# EasyEDA schematic SCH_Line_follower_tutorial_2023-11-12.json
TITLE: Sheet_Line_Follower; REV: 1.0; Date: 2023-10-26; Sheet: 1/1; Drawn By: DevelTeam; Company: DevelTeam
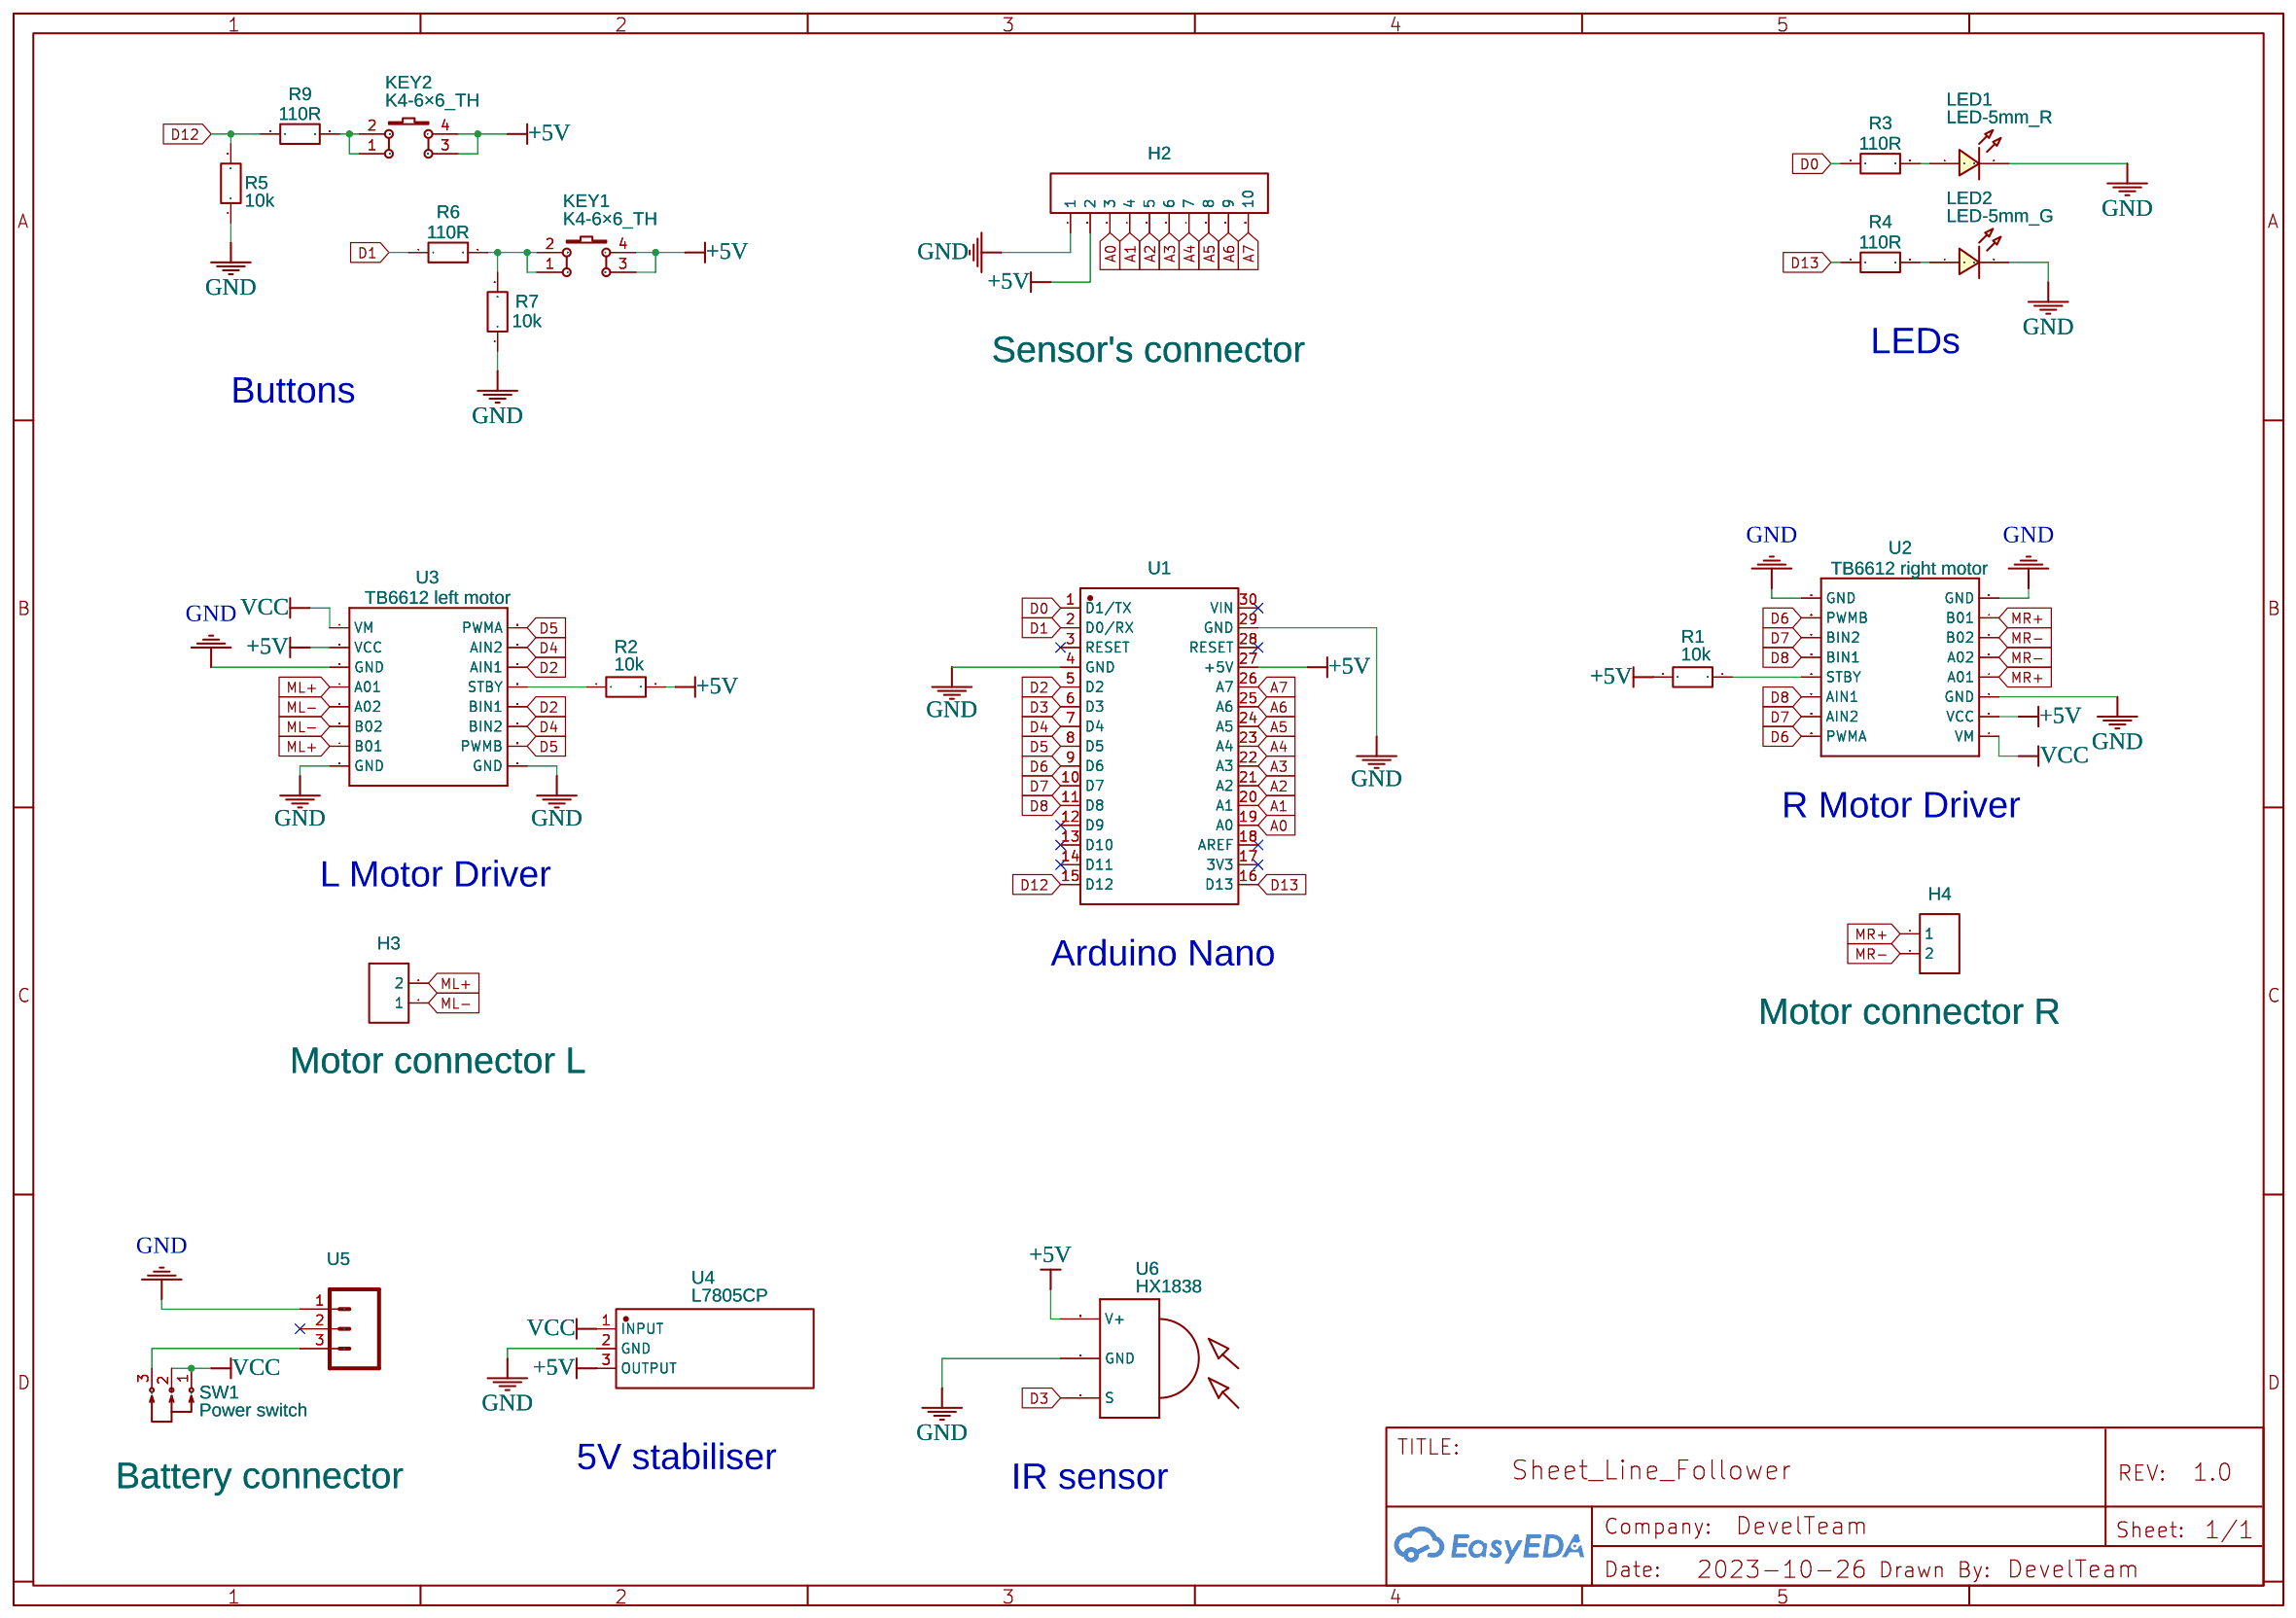
[diagram p0: schematic sheet]

## Parts
H2  Sensor's connector  [HDR-F-2.54_1X10]
H3  Motor connector L  [HDR-F-2.54_1X2]
H4  Motor connector R  [HDR-F-2.54_1X2]
KEY1  K4-6×6_TH  [KEY-TH_4P-L6.0-W6.0-P4.50-LS6.5]
KEY2  K4-6×6_TH  [KEY-TH_4P-L6.0-W6.0-P4.50-LS6.5]
LED1  LED-5mm_R  [LED-TH_BD5.0_RED]
LED2  LED-5mm_G  [LED-TH_BD5.0_GREEN]
R1  10k  [R_AXIAL-0.4]
R2  10k  [R_AXIAL-0.4]
R3  110R  [R_AXIAL-0.4]
R4  110R  [R_AXIAL-0.4]
R5  10k  [R_AXIAL-0.4]
R6  110R  [R_AXIAL-0.4]
R7  10k  [R_AXIAL-0.4]
R9  110R  [R_AXIAL-0.4]
SW1  Power switch  [SW-TH_SHOU-HAN_SS12D10G4]
U1  ARDUINO_NANO  [COMM-TH_ARDUINO_NANO]
U2  TB6612 right motor  [DUAL TB6612FNG]
U3  TB6612 left motor  [DUAL TB6612FNG]
U4  L7805CP  [TO-220FPAB-3_L10.4-W4.6-P2.54-T]
U5  Battery connector  [W-03 2.54]
U6  HX1838  [HX1838 STAND ALONE]

## Library data of the parts
H2 = HDR-F-2.54_1x10: Supplier Part: C35445; Supplier: LCSC; Contributor: LCEDA_Lib
H3 H4 = HDR-F-2.54_1x2: Supplier Part: C49661; Supplier: LCSC; Contributor: LCEDA_Lib
KEY1 KEY2 = K4-6×6_TH: Supplier: LCSC; Supplier Part: C136684; Manufacturer: 韩国韩荣; Manufacturer Part: K2-1102DP-E4SW-04; Contributor: LCEDA_Lib
LED1 = LED-TH-5mm_R: Manufacturer: EVERLIGHT(台湾亿光); Manufacturer Part: 333-2SURD/S530-A3; Supplier Part: C87271; Supplier: LCSC; Contributor: LCEDA_Lib
LED2 = LED-TH-5mm_G: Manufacturer: EVERLIGHT(台湾亿光); Manufacturer Part: 333-2SYGD/S530-E2; Supplier Part: C88163; Supplier: LCSC; Contributor: LCEDA_Lib
R1-R4 = R_AXIAL-0.5_EU: Contributor: LCEDA_Lib
R5-R7 R9 = R_AXIAL-0.4_EU: Contributor: LCEDA_Lib
SW1 = SS12D10G4 071: Contributor: LCSC; Supplier: LCSC; Supplier Part: C2887259; Manufacturer: SHOU HAN(首韩); JLCPCB Part Class: Extended Part; link: https://lcsc.com/eda_search?q=C2887259&%26type=1&ref=editor
U1 = ARDUINO_NANO: Contributor: lcsc; Supplier: LCSC; Supplier Part: C9900017879; Manufacturer: null; JLCPCB Part Class: Extended Part; link: https://lcsc.com/eda_search?q=C9900017879&%26type=1&ref=editor
U2 U3 = TB6612FNG 2 motor driver: TB6612 The TB6612FNG motor driver can control up to two DC motors at a constant current of 1.2A (3.2A peak).; Supplier: SparkFun
U4 = L7805CP: Contributor: LCSC; Supplier: LCSC; Supplier Part: C283396; Manufacturer: ST(意法半导体); JLCPCB Part Class: Extended Part; link: https://lcsc.com/eda_search?q=C283396&%26type=1&ref=editor
U5 = BALANCE W-03 (2.54MM): Contributor: xlamzerg
U6 = HX1838 STAND ALONE: Contributor: kleanair

## Nets
+5V: H2.2 KEY1.3 KEY1.4 KEY2.3 KEY2.4 R1.2 R2.2 U1.27(+5V) U2.2(VCC) U3.2(VCC) U4.3(OUTPUT) U6.VCC(V+)
GND: H2.1 LED1.2 LED2.2 R5.1 R7.1 U1.4(GND) U1.29(GND) U2.3(GND) U2.8(GND) U2.9(GND) U3.3(GND) U3.8(GND) U3.9(GND) U4.2(GND) U5.1 U6.GND
VCC: SW1.1 SW1.2 U2.1(VM) U3.1(VM) U4.1(INPUT)
A0: H2.3 U1.19(A0)
A1: H2.4 U1.20(A1)
A2: H2.5 U1.21(A2)
A3: H2.6 U1.22(A3)
A4: H2.7 U1.23(A4)
A5: H2.8 U1.24(A5)
A6: H2.9 U1.25(A6)
A7: H2.10 U1.26(A7)
D0: R3.1 U1.1(D1/TX)
D1: R6.1 U1.2(D0/RX)
D2: U1.5(D2) U3.12(BIN1) U3.14(AIN1)
D3: U1.6(D3) U6.S
D4: U1.7(D4) U3.11(BIN2) U3.15(AIN2)
D5: U1.8(D5) U3.10(PWMB) U3.16(PWMA)
D6: U1.9(D6) U2.10(PWMB) U2.16(PWMA)
D7: U1.10(D7) U2.11(BIN2) U2.15(AIN2)
D8: U1.11(D8) U2.12(BIN1) U2.14(AIN1)
D12: R5.2 R9.1 U1.15(D12)
D13: R4.1 U1.16(D13)
ML+: H3.2 U3.4(A01) U3.7(B01)
ML-: H3.1 U3.5(A02) U3.6(B02)
MR+: H4.1 U2.4(A01) U2.7(B01)
MR-: H4.2 U2.5(A02) U2.6(B02)
Net-(KEY1-1): KEY1.1 KEY1.2 R6.2 R7.2
Net-(KEY2-1): KEY2.1 KEY2.2 R9.2
Net-(LED1-1): LED1.1 R3.2
Net-(LED2-1): LED2.1 R4.2
Net-(R1-1): R1.1 U2.13(STBY)
Net-(R2-1): R2.1 U3.13(STBY)
Net-(SW1-3): SW1.3 U5.3

Not connected (* = marked no-connect by the designer): U1 3(RESET)* 12(D9)* 13(D10)* 14(D11)* 17(3V3)* 18(AREF)* 28(RESET)* 30(VIN)*; U5 2*

## Notes on the sheet
- LEDs
- Buttons
- R Motor Driver
- L Motor Driver
- Arduino Nano
- 5V stabiliser
- IR sensor
